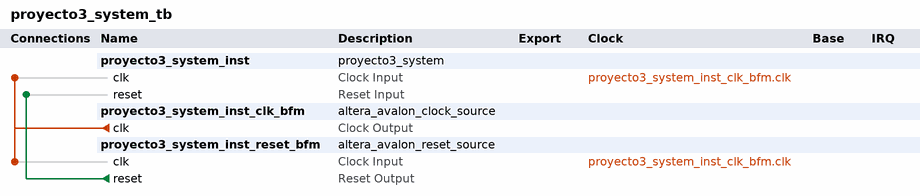
[diagram p0: system contents]
# Platform Designer (Qsys) system proyecto3_system_tb, Cyclone V 5CSEMA4U23C6
# Parameters at their usual value, and those the tool derives, are not listed.
package require -exact qsys 16.0
create_system proyecto3_system_tb
set_project_property DEVICE_FAMILY {Cyclone V}
set_project_property DEVICE 5CSEMA4U23C6

add_instance proyecto3_system_inst proyecto3_system 1.0

add_instance proyecto3_system_inst_clk_bfm altera_avalon_clock_source 16.0

add_instance proyecto3_system_inst_reset_bfm altera_avalon_reset_source 16.0
set_instance_parameter_value proyecto3_system_inst_reset_bfm ASSERT_HIGH_RESET 0
set_instance_parameter_value proyecto3_system_inst_reset_bfm INITIAL_RESET_CYCLES 50

# connections
add_connection proyecto3_system_inst_clk_bfm.clk proyecto3_system_inst.clk clock
add_connection proyecto3_system_inst_clk_bfm.clk proyecto3_system_inst_reset_bfm.clk clock
add_connection proyecto3_system_inst_reset_bfm.reset proyecto3_system_inst.reset reset

set_interconnect_requirement {$system} qsys_mm.clockCrossingAdapter HANDSHAKE
set_interconnect_requirement {$system} qsys_mm.enableEccProtection FALSE
set_interconnect_requirement {$system} qsys_mm.insertDefaultSlave FALSE
set_interconnect_requirement {$system} qsys_mm.maxAdditionalLatency 1

save_system proyecto3_system_tb.qsys
